# Altium schematic sheet ADC.SchDoc
size A4
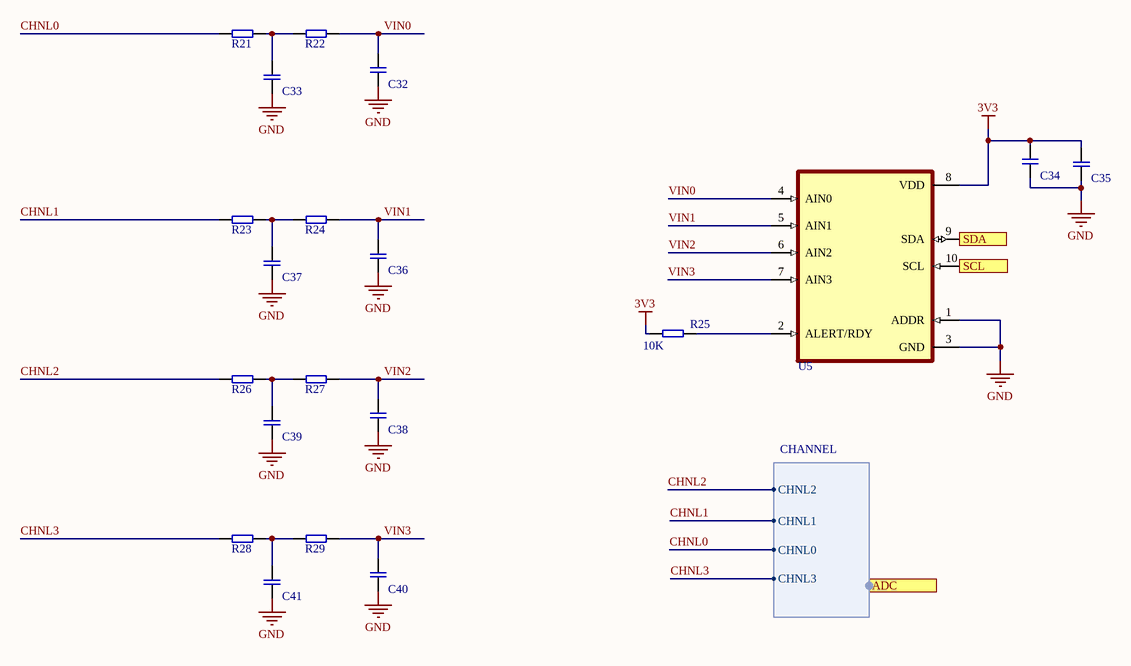
[diagram p0: ADC.SchDoc]

## Parts
C32  0.1uF  [C0603]  (value not drawn)
C33  0.1uF  [C0603]  (value not drawn)
C34  1uF  [C0603]  (value not drawn)
C35  10uF  [C0603]  (value not drawn)
C36  0.1uF  [C0603]  (value not drawn)
C37  0.1uF  [C0603]  (value not drawn)
C38  0.1uF  [C0603]  (value not drawn)
C39  0.1uF  [C0603]  (value not drawn)
C40  0.1uF  [C0603]  (value not drawn)
C41  0.1uF  [C0603]  (value not drawn)
R21  0R  [R0402]  (value not drawn)
R22  0R  [R0402]  (value not drawn)
R23  0R  [R0402]  (value not drawn)
R24  0R  [R0402]  (value not drawn)
R25  10K  [R0603]
R26  0R  [R0402]  (value not drawn)
R27  0R  [R0402]  (value not drawn)
R28  0R  [R0402]  (value not drawn)
R29  0R  [R0402]  (value not drawn)
U5  ADS1115IDGST  [ADS1115IDGST]  (value not drawn)

## Ports
ADC (harness CHANNEL), SCL, SDA

## Harnesses
CHANNEL: CHNL0, CHNL1, CHNL2, CHNL3

## Nets
3V3: C34.2 C35.2 R25.1 U5.8(VDD)
GND: C32.2 C33.1 C34.1 C35.1 C36.2 C37.1 C38.2 C39.1 C40.2 C41.1 U5.1(ADDR) U5.3(GND)
CHNL0: R21.1 ; port ADC.CHNL0
CHNL1: R23.1 ; port ADC.CHNL1
CHNL2: R26.1 ; port ADC.CHNL2
CHNL3: R28.1 ; port ADC.CHNL3
SCL: U5.10(SCL) ; port SCL
SDA: U5.9(SDA) ; port SDA
VIN0: C32.1 R22.2 U5.4(AIN0)
VIN1: C36.1 R24.2 U5.5(AIN1)
VIN2: C38.1 R27.2 U5.6(AIN2)
VIN3: C40.1 R29.2 U5.7(AIN3)
NetC33_2: C33.2 R21.2 R22.1
NetC37_2: C37.2 R23.2 R24.1
NetC39_2: C39.2 R26.2 R27.1
NetC41_2: C41.2 R28.2 R29.1
NetR25_2: R25.2 U5.2(ALERT/RDY)

## Library data of the parts
C32 C33 C36-C41 = C0603C104J4RACTU: CAP CER 0.1UF 16V X7R 0603; Manufacturer: KEMET; Que: 071; Tolerance: ±5%; Type: Ceramic; Name: Recep Aydin; Part Number: C0603C104J4RACTU; Voltage: 16V; Temperature Coefficient: X7R; Package: 0603(1608 Metric); Datasheet: https://content.kemet.com/datasheets/KEM_C1002_X7R_SMD.pdf; Manufacturer Part Number: C0603C104J4RACTU
C34 = GMC10X5R105K16NT: CAP CER 1UF 16V X5R 0603; Manufacturer: CAL-CHIP ELECTRONICS, INC.; Que: 020; Tolerance: ±10%; Type: Ceramic; Name: Recep Aydin; Part Number: GMC10X5R105K16NT; Voltage: 16V; Temperature Coefficient: X5R; Package: 0603(1608 Metric); Datasheet: http://www.calchipelectronics.com/pdf/gmc_series.pdf; Manufacturer Part Number: GMC10X5R105K16NT
C35 = GRT188R61C106KE13D: CAP CER 10UF 16V X5R 0603; Manufacturer: Murata Electronics; Que: 073; Tolerance: ±10%; Type: Ceramic; Name: Recep Aydin; Part Number: GRT188R61C106KE13D; Voltage: 16V; Temperature Coefficient: X5R; Package: 0603(1608 Metric); Datasheet: https://search.murata.co.jp/Ceramy/image/img/A01X/G101/ENG/GRT188R61C106KE13-01.pdf; Manufacturer Part Number: GRT188R61C106KE13D
R21-R24 R26-R29 = RMCF0402ZT0R00: RES 0 OHM JUMPER 1/16W 0402; Manufacturer: Stackpole Electronics Inc; Que: 056; Tolerance: 1%; Name: Recep Aydin; Part Number: RMCF0402ZT0R00; Resistor Type: Thick Film; Package: 0402; Datasheet: https://www.seielect.com/catalog/sei-rmcf_rmcp.pdf; Manufacturer Part Number: RMCF0402ZT0R00
R25 = RMCF0603FT10K0: RES 10K OHM 1% 1/10W 0603; Manufacturer: Stackpole Electronics Inc; Que: 051; Name: Recep Aydin; Part Number: RMCF0603FT10K0; Tolerance: 1%; Resistor Type: Thick Film; Package: 0603; Datasheet: https://www.seielect.com/catalog/sei-rmcf_rmcp.pdf; Manufacturer Part Number: RMCF0603FT10K0
U5 = ADS1115IDGST: IC ADC 16BIT SIGMA-DELTA 10VSSOP; Manufacturer: Texas Instruments; Que: 047; Name: İbrahim Akbulut; Package: 10VSSOP; Availability: Unavailable; Value: *; MP: ADS1115IDGST; Price: None; Part Number: ADS1115IDGST; Function: ADC; Datasheet: https://www.digikey.com/en/products/detail/texas-instruments/ADS1115IDGST/2123284; Manufacturer Part Number: ADS1115IDGST